# Altium schematic sheet Sheet1.SchDoc
size A4; Organization: Altium Limited; Address1: L3, 12a Rodborough Rd; Address2: Frenchs Forest; Address3: NSW; Address4: Australia 2086
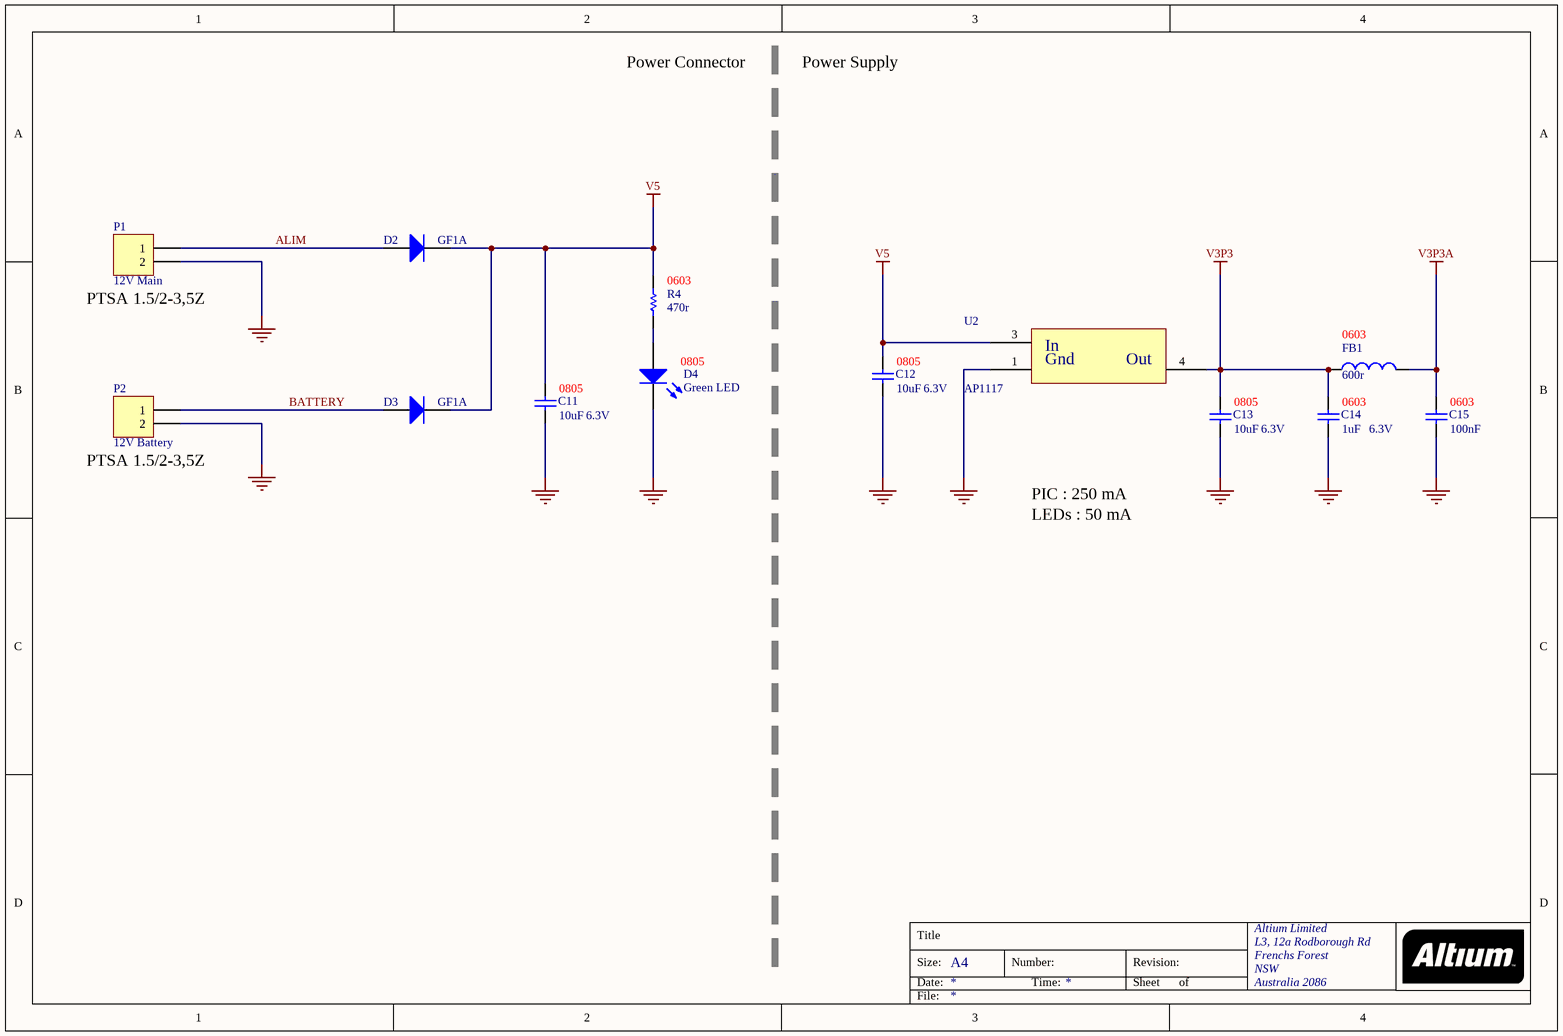
[diagram p0: Sheet1.SchDoc]

## Parts
C11  6.3V  value 10uF  [CAPC2012N]
C12  6.3V  value 10uF  [CAPC2012N]
C13  6.3V  value 10uF  [CAPC2012N]
C14  6.3V  value 1uF  [CAPC1608N]
C15  value 100nF  [CAPC1608N]  (hidden comment: 6.3V)
D2  GF1A  [GF1A Diode]
D3  GF1A  [GF1A Diode]
D4  Green LED  [LED 0805N]
FB1  value 600r  [INDC1608AN]  (hidden comment: Inductor)
P1  12V Main  [PHOENIX_1985195]
P2  12V Battery  [PHOENIX_1985195]
R4  value 470r  [RESC1608N]  (hidden comment: Res1)
U2  AP1117  [TD03B_N]

## Nets
GND: C11.1 C12.1 C13.1 C14.1 C15.1 D4.2(K) P1.2 P2.2 U2.1
V3P3: C13.2 C14.2 FB1.1 U2.4
V3P3A: C15.2 FB1.2
V5: C11.2 C12.2 D2.2(K) D3.2(K) R4.2 U2.3
ALIM: D2.1(A) P1.1
BATTERY: D3.1(A) P2.1
NetD4_1: D4.1(A) R4.1

## Notes on the sheet
- Power Connector
- Power Supply
- (near P1) PTSA 1.5/2-3,5Z
- (near R4) 0603
- (near D4) 0805
- (near C12) 0805
- (near FB1) 0603
- (near C11) 0805
- (near C13) 0805
- (near C14) 0603
- (near C15) 0603
- (near P2) PTSA 1.5/2-3,5Z
- PIC : 250 mA
- LEDs : 50 mA
- Title
- Size:
- Date:
- A4
- Number:
- Time:
- Revision:
- Sheet
- of
- File:
- (in symbol AP1117) In; Gnd; Out

## Library data of the parts
C11-C13 = Cap: Capacitor; Reference_fabricant: C2012X5R0J106M/1.25; Fabricant: TDK; Fournisseur: Farnell; Reference_fournisseur: 2309029; Precision: 6.3V X5R; Published: 8-Jun-2000; LatestRevisionDate: 17-Jul-2002; LatestRevisionNote: Re-released for DXP Platform.; PackageReference: RAD-0.3; Publisher: Altium Limited; PackageDescription: Radial Cap, Thru-Hole; 2 Leads; 0.3 in Pin Spacing
C14 C15 = Cap: Capacitor; Precision: 6.3V X5R; Fournisseur: Farnell; Published: 8-Jun-2000; LatestRevisionDate: 17-Jul-2002; LatestRevisionNote: Re-released for DXP Platform.; PackageReference: RAD-0.3; Publisher: Altium Limited; PackageDescription: Radial Cap, Thru-Hole; 2 Leads; 0.3 in Pin Spacing
D2 D3 = Diode: Default Diode; Published: 8-Jun-2000; LatestRevisionDate: 17-Jul-2002; LatestRevisionNote: Re-released for DXP Platform.; PackageVersion: Sep-1996; PackageReference: SMC; Publisher: Altium Limited; PackageDescription: DO-214-AB/SMC; 2 C-Bend Leads; Body 7.9 x 5.9 mm, inc. leads (LxW); Code_JEDEC: DO-214-AB; Fabriquant: *; Fournisseur: *; Reference_fournisseur: *; Reference_fabriquant: *
D4 = LED0: Typical INFRARED GaAs LED; Published: 8-Jun-2000; LatestRevisionDate: 08-Jul-2005; LatestRevisionNote: Mech Layer 1 removed.; PackageReference: LED-0; Publisher: Altium Limited; PackageDescription: LED; 2 Leads
FB1 = Inductor: Code_IEC: 1005; Published: 8-Jun-2000; LatestRevisionDate: 29-May-2009; LatestRevisionNote: IPC-7351 Footprint Added.; PackageReference: 0402-A; Publisher: Altium Limited; PackageDescription: Chip Inductor; Code_JEITA: 0402
P1 P2 = Header 2H: Header, 2-Pin, Right Angle; LatestRevisionDate: 17-Jul-2002; LatestRevisionNote: Re-released for DXP Platform.; Publisher: Altium Limited
R4 = Res1: Resistor; Published: 8-Jun-2000; LatestRevisionDate: 17-Jul-2002; LatestRevisionNote: Re-released for DXP Platform.; PackageReference: AXIAL-0.3; Publisher: Altium Limited; PackageDescription: Axial Device, Thru-Hole; 2 Leads; 0.3 in Pin Spacing